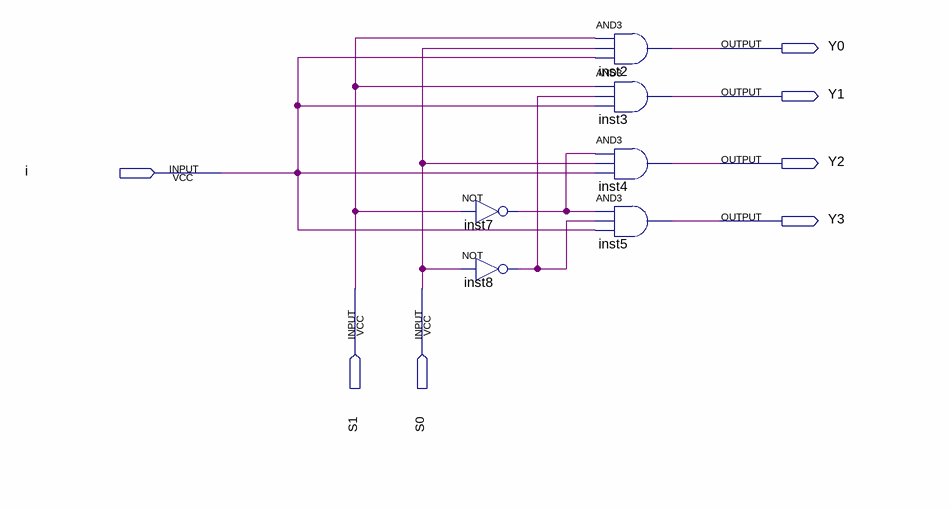
[diagram p0: schematic sheet]
// Quartus schematic Block1.bdf as structural Verilog: 6 symbols, 7 pins
module Block1 (
  input  i,
  input  S1,
  input  S0,
  output Y0,
  output Y1,
  output Y2,
  output Y3
);

  wire inst7_out, inst8_out;

  not inst7 (inst7_out, S1);
  not inst8 (inst8_out, S0);
  and inst2 (Y0, S1, S0, i);
  and inst3 (Y1, S1, inst8_out, i);
  and inst4 (Y2, inst7_out, S0, i);
  and inst5 (Y3, inst7_out, inst8_out, i);
endmodule
